# Altium schematic sheet Main Control Board.SchDoc
size A; SheetNumber: 2; SheetTotal: 2
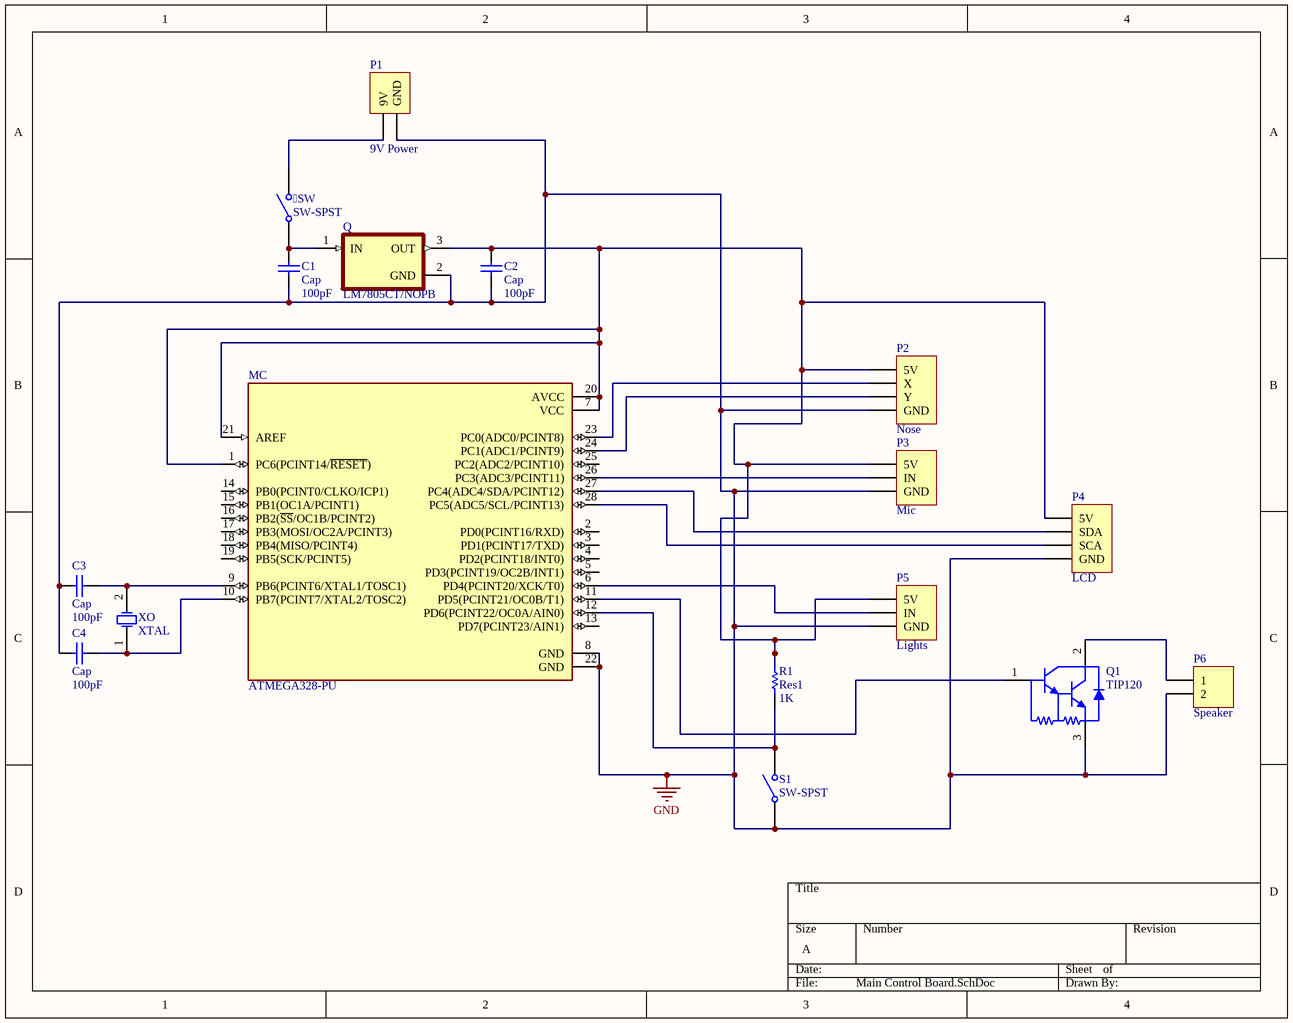
[diagram p0: Main Control Board.SchDoc]

## Parts
SW  SW-SPST  [SPST-2]
C1  Cap  value 100pF  [RAD-0.3]
C2  Cap  value 100pF  [RAD-0.3]
C3  Cap  value 100pF  [RAD-0.3]
C4  Cap  value 100pF  [RAD-0.3]
MC  ATMEGA328-PU  [DIP787W46P254L3467H508Q28]
P1  9V Power  [HDR1X2]
P2  Nose  [HDR1X4]
P3  Mic  [HDR1X3]
P4  LCD  [HDR1X4]
P5  Lights  [HDR1X3]
P6  Speaker  [HDR1X2]
Q  LM7805CT/NOPB  [TO254P1054X470X2600-3]
Q1  TIP120  [ONSC-TO-220-3-221A-09]
R1  Res1  value 1K  [AXIAL-0.3]
S1  SW-SPST  [SPST-2]
XO  XTAL  [R38]

## Nets
GND: C1.2 C2.2 C3.1 C4.1 MC.8(GND) MC.22(GND) P1.2(GND) P2.4(GND) P3.3(GND) P4.4(GND) P5.3(GND) P6.2 Q.2(GND) Q1.3(E) S1.1(COMMON)
NetSW_1: SW.1(COMMON) C1.1 Q.1(IN)
NetSW_2: SW.2(NO) P1.1(9V)
NetC2_1: C2.1 MC.1(PC6(PCINT14/~{RESET})) MC.7(VCC) MC.20(AVCC) MC.21(AREF) P2.1(5V) P3.1(5V) P4.1(5V) P5.1(5V) Q.3(OUT) R1.2
NetC3_2: C3.2 MC.9(PB6(PCINT6/XTAL1/TOSC1)) XO.2(OSC2)
NetC4_2: C4.2 MC.10(PB7(PCINT7/XTAL2/TOSC2)) XO.1(OSC1)
NetMC_6: MC.6(PD4(PCINT20/XCK/T0)) P5.2(IN)
NetMC_11: MC.11(PD5(PCINT21/OC0B/T1)) Q1.1(B)
NetMC_12: MC.12(PD6(PCINT22/OC0A/AIN0)) R1.1 S1.2(NO)
NetMC_23: MC.23(PC0(ADC0/PCINT8)) P2.2(X)
NetMC_24: MC.24(PC1(ADC1/PCINT9)) P2.3(Y)
NetMC_26: MC.26(PC3(ADC3/PCINT11)) P3.2(IN)
NetMC_27: MC.27(PC4(ADC4/SDA/PCINT12)) P4.2(SDA)
NetMC_28: MC.28(PC5(ADC5/SCL/PCINT13)) P4.3(SCA)
NetP6_1: P6.1 Q1.2(C)

Not connected (* = marked no-connect by the designer): MC 2(PD0(PCINT16/RXD)) 3(PD1(PCINT17/TXD)) 4(PD2(PCINT18/INT0)) 5(PD3(PCINT19/OC2B/INT1)) 13(PD7(PCINT23/AIN1)) 14(PB0(PCINT0/CLKO/ICP1)) 15(PB1(OC1A/PCINT1)) 16(PB2(~{SS}/OC1B/PCINT2)) 17(PB3(MOSI/OC2A/PCINT3)) 18(PB4(MISO/PCINT4)) 19(PB5(SCK/PCINT5)) 25(PC2(ADC2/PCINT10))

## Library data of the parts
SW S1 = SW-SPST: Single-Pole, Single-Throw Switch; Published: 24-Mar-1999; LatestRevisionDate: 17-Jul-2002; LatestRevisionNote: Re-released for DXP Platform.; PackageReference: SPST-2; Publisher: Altium Limited; PackageDescription: Switch; 2 Leads
C1-C4 = Cap: Capacitor; Published: 8-Jun-2000; LatestRevisionDate: 17-Jul-2002; LatestRevisionNote: Re-released for DXP Platform.; PackageReference: RAD-0.3; Publisher: Altium Limited; PackageDescription: Radial Cap, Thru-Hole; 2 Leads; 0.3 in Pin Spacing
MC = ATMEGA328-PU: AVR AVRÂ® ATmega Microcontroller IC 8-Bit 20MHz 32KB (16K x 16) FLASH 28-PDIP; MF: Microchip Technology; Value: *; Package: DIP-28 Microchip Technology; Availability: In Stock; Check_prices: https://www.snapeda.com/parts/ATMEGA328-PU/Microchip/view-part/?ref=eda; SnapEDA_Link: https://www.snapeda.com/parts/ATMEGA328-PU/Microchip/view-part/?ref=snap; Purchase-URL: https://pricing.snapeda.com/search/part/ATMEGA328-PU/?ref=eda; MP: ATMEGA328-PU; Price: None
P1 P6 = Header 2: Header, 2-Pin; LatestRevisionDate: 17-Jul-2002; LatestRevisionNote: Re-released for DXP Platform.; Publisher: Altium Limited
P2 P4 = Header 4: Header, 4-Pin; LatestRevisionDate: 17-Jul-2002; LatestRevisionNote: Re-released for DXP Platform.; Publisher: Altium Limited
P3 P5 = Header 3: Header, 3-Pin; LatestRevisionDate: 17-Jul-2002; LatestRevisionNote: Re-released for DXP Platform.; Publisher: Altium Limited
Q = LM7805CT/NOPB: Linear Voltage Regulator IC 1 Output 1A TO-220-3; MF: ON Semiconductor; MP: LM7805CT; SnapEDA_Link: https://www.snapeda.com/parts/LM7805CT/ON%20Semiconductor/view-part/546231/?ref=snap; Price: None; Package: TO-220 ON Semiconductor; Value: *; Availability: Unavailable
Q1 = CMP-013-00001-2: Plastic Medium-Power Complementary Silicon Transistor, 60 V VCEO, -65 to 150 degC, 3-Pin TO-220, RoHS, Tube; Manufacturer: ON Semiconductor; hFE Min: 1000; Package Version: Rev. AH, 08/2014; Vce Max: 4V; Min Operating Temperature: -65°C; Case/Package: TO-220-3; Max Operating Temperature: 150°C; Package Quantity: 50; Mounting Technology: TH; Package Description: 3-Pin Flange Mount, Vertical Straight Lead, Body 10.095 x 4.45 mm, Pitch 2.54 mm; Datasheet Version: Rev. 9, 11/2014; Package Reference: TO-220-3-221A-09; Datasheet URL: http://www.onsemi.cn/pub_link/Collateral/TIP120-D.PDF; Pins: 3; RoHS Compliant: True; Packaging: Rail/Tube
R1 = Res1: Resistor; Published: 8-Jun-2000; LatestRevisionDate: 17-Jul-2002; LatestRevisionNote: Re-released for DXP Platform.; PackageReference: AXIAL-0.3; Publisher: Altium Limited; PackageDescription: Axial Device, Thru-Hole; 2 Leads; 0.3 in Pin Spacing
XO = XTAL: Crystal Oscillator; Published: 8-Jun-2000; LatestRevisionDate: 17-Jul-2002; LatestRevisionNote: Re-released for DXP Platform.; PackageReference: R38; Publisher: Altium Limited; PackageDescription: Crystal, Thru-Hole; 2 Leads; Body 3.1 x 8.2 mm (Dia.xH)